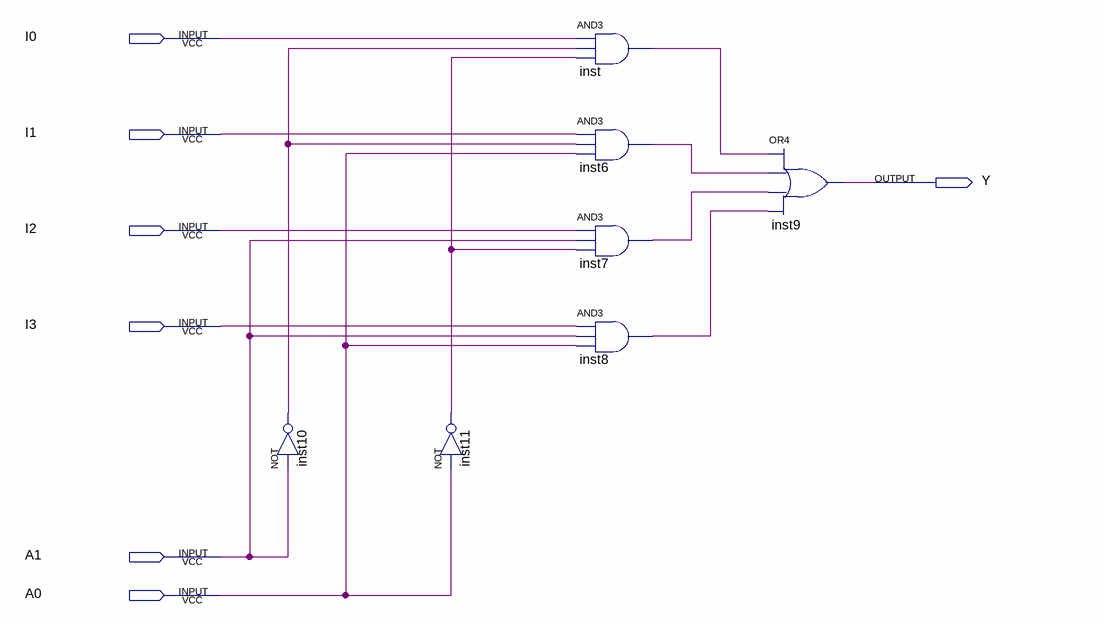
[diagram p0: schematic sheet]
// Quartus schematic ea01m01e02.bdf as structural Verilog: 7 symbols, 7 pins
module ea01m01e02 (
  input  I0,
  input  I1,
  input  I2,
  input  I3,
  input  A1,
  input  A0,
  output Y
);

  wire inst6_out, inst7_out, inst8_out, inst10_out, inst11_out, inst_out;

  not inst10 (inst10_out, A1);
  not inst11 (inst11_out, A0);
  and inst (inst_out, I0, inst10_out, inst11_out);
  and inst6 (inst6_out, I1, inst10_out, A0);
  and inst7 (inst7_out, I2, A1, inst11_out);
  and inst8 (inst8_out, I3, A1, A0);
  or inst9 (Y, inst_out, inst6_out, inst7_out, inst8_out);
endmodule
